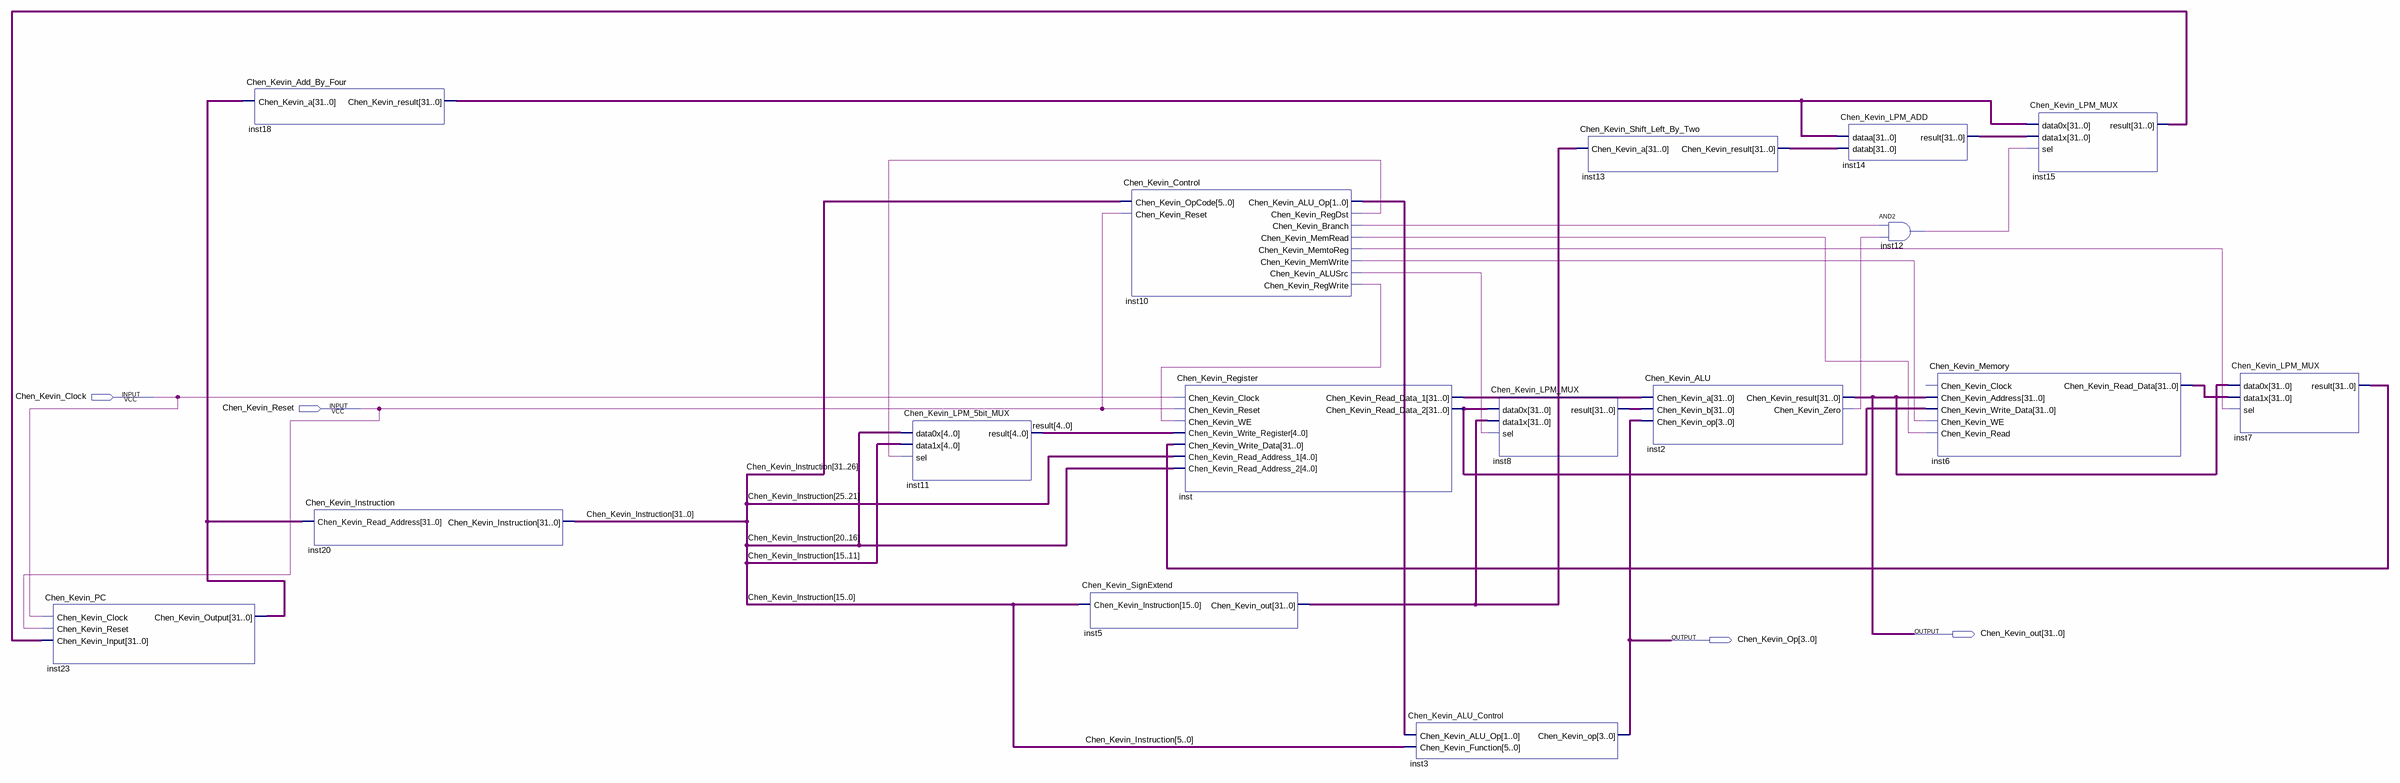
[diagram p0: schematic sheet]
// Quartus schematic Chen_Kevin_Single_Cycle_CPU.bdf as structural Verilog: 16 symbols, 4 pins
module Chen_Kevin_Single_Cycle_CPU (
  input  Chen_Kevin_Clock,
  input  Chen_Kevin_Reset,
  output [31:0] Chen_Kevin_out,
  output [3:0] Chen_Kevin_Op
);

  wire inst2_chen_kevin_zero, inst10_chen_kevin_alusrc, inst10_chen_kevin_branch, inst10_chen_kevin_memread,
       inst10_chen_kevin_memtoreg, inst10_chen_kevin_memwrite, inst10_chen_kevin_regdst,
       inst10_chen_kevin_regwrite, inst12_out;
  wire [1:0] inst10_chen_kevin_alu_op;
  wire [4:0] result;
  wire [31:0] Chen_Kevin_Instruction, inst5_chen_kevin_out, inst6_chen_kevin_read_data, inst7_result,
       inst8_result, inst13_chen_kevin_result, inst14_result, inst15_result, inst18_chen_kevin_result,
       inst23_chen_kevin_output, inst_chen_kevin_read_data_1, inst_chen_kevin_read_data_2;

  Chen_Kevin_PC inst23 (
    .Chen_Kevin_Clock(Chen_Kevin_Clock), .Chen_Kevin_Reset(Chen_Kevin_Reset),
    .Chen_Kevin_Input(inst15_result), .Chen_Kevin_Output(inst23_chen_kevin_output));
  Chen_Kevin_Add_By_Four inst18 (.Chen_Kevin_a(inst23_chen_kevin_output), .Chen_Kevin_result(inst18_chen_kevin_result));
  Chen_Kevin_Instruction inst20 (
    .Chen_Kevin_Read_Address(inst23_chen_kevin_output), .Chen_Kevin_Instruction(Chen_Kevin_Instruction));
  Chen_Kevin_LPM_5bit_MUX inst11 (
    .data0x(Chen_Kevin_Instruction[20:16]), .data1x(Chen_Kevin_Instruction[15:11]),
    .sel(inst10_chen_kevin_regdst), .result(result));
  Chen_Kevin_SignExtend inst5 (
    .Chen_Kevin_Instruction(Chen_Kevin_Instruction[15:0]), .Chen_Kevin_out(inst5_chen_kevin_out));
  Chen_Kevin_Control inst10 (
    .Chen_Kevin_OpCode(Chen_Kevin_Instruction[31:26]), .Chen_Kevin_Reset(Chen_Kevin_Reset),
    .Chen_Kevin_ALU_Op(inst10_chen_kevin_alu_op), .Chen_Kevin_RegDst(inst10_chen_kevin_regdst),
    .Chen_Kevin_Branch(inst10_chen_kevin_branch), .Chen_Kevin_MemRead(inst10_chen_kevin_memread),
    .Chen_Kevin_MemtoReg(inst10_chen_kevin_memtoreg), .Chen_Kevin_MemWrite(inst10_chen_kevin_memwrite),
    .Chen_Kevin_ALUSrc(inst10_chen_kevin_alusrc), .Chen_Kevin_RegWrite(inst10_chen_kevin_regwrite));
  Chen_Kevin_Register inst (
    .Chen_Kevin_Clock(Chen_Kevin_Clock), .Chen_Kevin_Reset(Chen_Kevin_Reset),
    .Chen_Kevin_WE(inst10_chen_kevin_regwrite), .Chen_Kevin_Write_Register(result),
    .Chen_Kevin_Write_Data(inst7_result), .Chen_Kevin_Read_Address_1(Chen_Kevin_Instruction[25:21]),
    .Chen_Kevin_Read_Address_2(Chen_Kevin_Instruction[20:16]),
    .Chen_Kevin_Read_Data_1(inst_chen_kevin_read_data_1), .Chen_Kevin_Read_Data_2(inst_chen_kevin_read_data_2));
  Chen_Kevin_ALU_Control inst3 (
    .Chen_Kevin_ALU_Op(inst10_chen_kevin_alu_op), .Chen_Kevin_Function(Chen_Kevin_Instruction[5:0]),
    .Chen_Kevin_op(Chen_Kevin_Op));
  Chen_Kevin_LPM_MUX inst8 (
    .data0x(inst_chen_kevin_read_data_2), .data1x(inst5_chen_kevin_out), .sel(inst10_chen_kevin_alusrc),
    .result(inst8_result));
  Chen_Kevin_Shift_Left_By_Two inst13 (
    .Chen_Kevin_a(inst5_chen_kevin_out), .Chen_Kevin_result(inst13_chen_kevin_result));
  Chen_Kevin_ALU inst2 (
    .Chen_Kevin_a(inst_chen_kevin_read_data_1), .Chen_Kevin_b(inst8_result), .Chen_Kevin_op(Chen_Kevin_Op),
    .Chen_Kevin_result(Chen_Kevin_out), .Chen_Kevin_Zero(inst2_chen_kevin_zero));
  Chen_Kevin_LPM_ADD inst14 (
    .dataa(inst18_chen_kevin_result), .datab(inst13_chen_kevin_result), .result(inst14_result));
  and inst12 (inst12_out, inst10_chen_kevin_branch, inst2_chen_kevin_zero);
  Chen_Kevin_Memory inst6 (
    .Chen_Kevin_Address(Chen_Kevin_out), .Chen_Kevin_Write_Data(inst_chen_kevin_read_data_2),
    .Chen_Kevin_WE(inst10_chen_kevin_memwrite), .Chen_Kevin_Read(inst10_chen_kevin_memread),
    .Chen_Kevin_Read_Data(inst6_chen_kevin_read_data));  // open: Chen_Kevin_Clock
  Chen_Kevin_LPM_MUX inst15 (
    .data0x(inst18_chen_kevin_result), .data1x(inst14_result), .sel(inst12_out), .result(inst15_result));
  Chen_Kevin_LPM_MUX inst7 (
    .data0x(Chen_Kevin_out), .data1x(inst6_chen_kevin_read_data), .sel(inst10_chen_kevin_memtoreg),
    .result(inst7_result));
endmodule
